# Altium schematic sheet Kilobot_Controller_IR.SchDoc
size A4
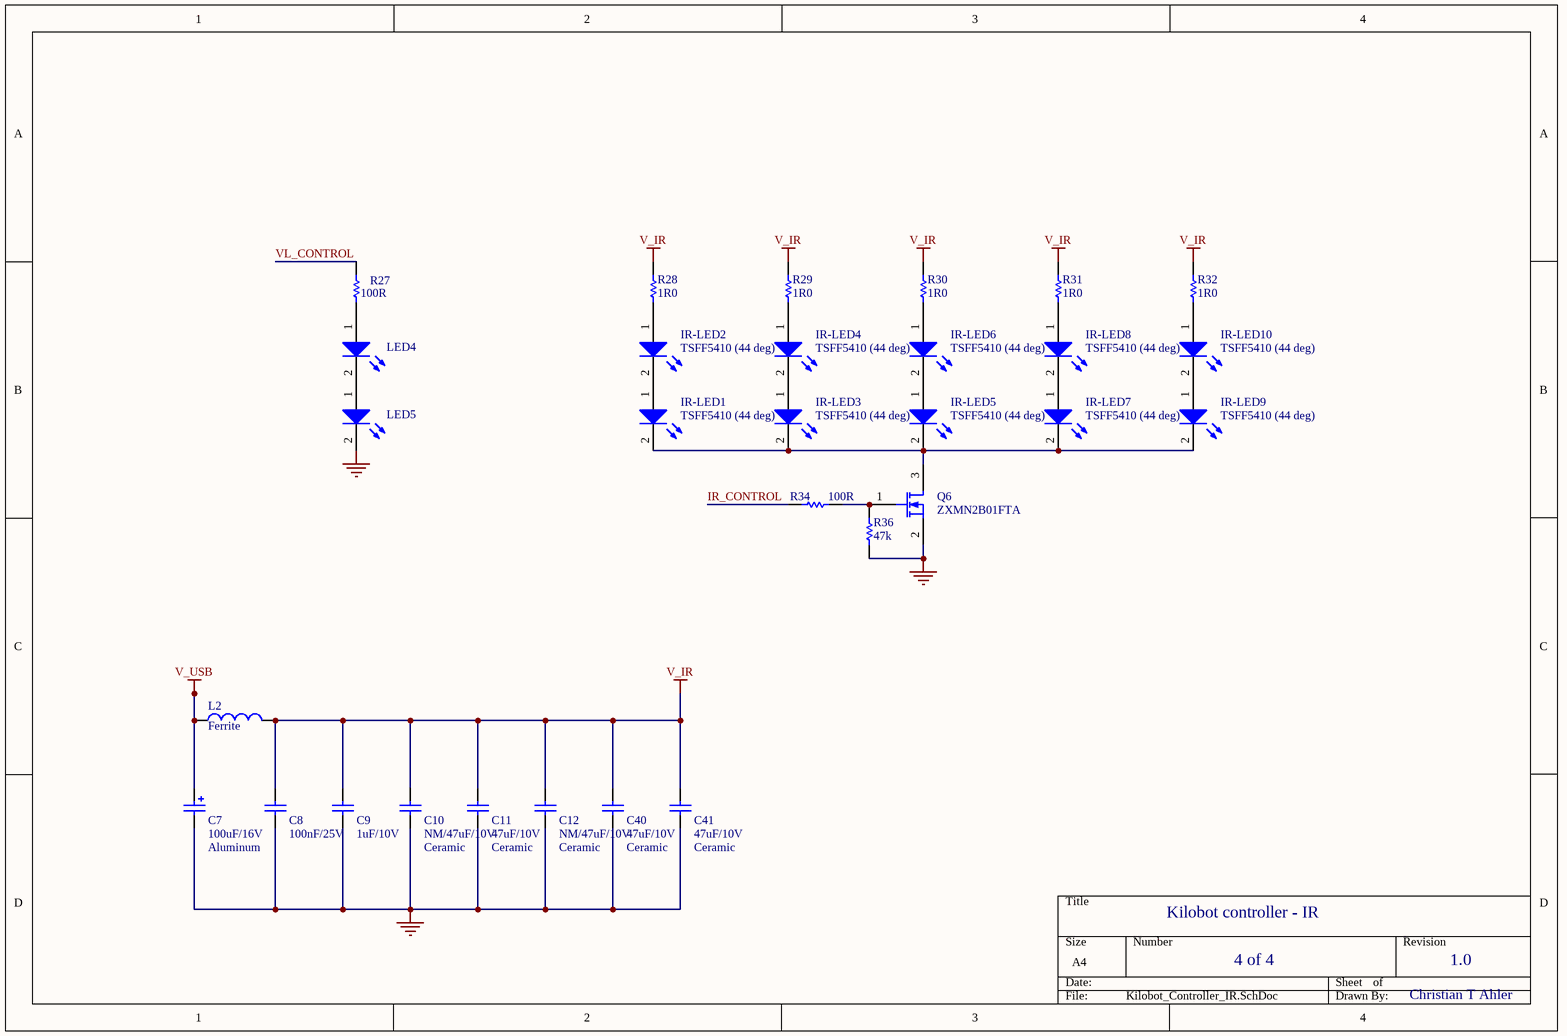
[diagram p0: Kilobot_Controller_IR.SchDoc]

## Parts
C7  Aluminum  value 100uF/16V  [cap5mm]
C8  value 100nF/25V  [RESC1608L]  (hidden comment: C0603)
C9  value 1uF/10V  [RESC1608L]  (hidden comment: C0603)
C10  Ceramic  value NM/47uF/10V  [8RB-1206]
C11  Ceramic  value 47uF/10V  [8RB-1206]
C12  Ceramic  value NM/47uF/10V  [8RB-1206]
C40  Ceramic  value 47uF/10V  [8RB-1206]
C41  Ceramic  value 47uF/10V  [8RB-1206]
IR-LED1  value TSFF5410 (44 deg)  [IR-LED]  (hidden comment: IR-LED)
IR-LED2  value TSFF5410 (44 deg)  [IR-LED]  (hidden comment: IR-LED)
IR-LED3  value TSFF5410 (44 deg)  [IR-LED]  (hidden comment: IR-LED)
IR-LED4  value TSFF5410 (44 deg)  [IR-LED]  (hidden comment: IR-LED)
IR-LED5  value TSFF5410 (44 deg)  [IR-LED]  (hidden comment: IR-LED)
IR-LED6  value TSFF5410 (44 deg)  [IR-LED]  (hidden comment: IR-LED)
IR-LED7  value TSFF5410 (44 deg)  [IR-LED]  (hidden comment: IR-LED)
IR-LED8  value TSFF5410 (44 deg)  [IR-LED]  (hidden comment: IR-LED)
IR-LED9  value TSFF5410 (44 deg)  [IR-LED]  (hidden comment: IR-LED)
IR-LED10  value TSFF5410 (44 deg)  [IR-LED]  (hidden comment: IR-LED)
L2  Ferrite  [RESC2012N]
LED4  LED  [LED0603]  (value not drawn)
LED5  LED  [LED0603]  (value not drawn)
Q6  value ZXMN2B01FTA  [sot23-3]  (hidden comment: NMOS23)
R27  value 100R  [RESC1608L]  (hidden comment: Res1)
R28  value 1R0  [RESC2012L]  (hidden comment: Res1)
R29  value 1R0  [RESC2012L]  (hidden comment: Res1)
R30  value 1R0  [RESC2012L]  (hidden comment: Res1)
R31  value 1R0  [RESC2012L]  (hidden comment: Res1)
R32  value 1R0  [RESC2012L]  (hidden comment: Res1)
R34  value 100R  [RESC1608L]  (hidden comment: Res1)
R36  value 47k  [RESC1608L]  (hidden comment: Res1)

## Nets
GND: C7.2 C8.2 C9.1 C10.1 C11.1 C12.1 C40.1 C41.1 LED5.2(K) Q6.2(S) R36.1
V_IR: C8.1 C9.2 C10.2 C11.2 C12.2 C40.2 C41.2 L2.2 R28.2 R29.2 R30.2 R31.2 R32.2
V_USB: C7.1 L2.1
IR_CONTROL: R34.2
VL_CONTROL: R27.2
NetIR-LED1_1: IR-LED1.1(A) IR-LED2.2(K)
NetIR-LED1_2: IR-LED1.2(K) IR-LED3.2(K) IR-LED5.2(K) IR-LED7.2(K) IR-LED9.2(K) Q6.3(D)
NetIR-LED2_1: IR-LED2.1(A) R28.1
NetIR-LED3_1: IR-LED3.1(A) IR-LED4.2(K)
NetIR-LED4_1: IR-LED4.1(A) R29.1
NetIR-LED5_1: IR-LED5.1(A) IR-LED6.2(K)
NetIR-LED6_1: IR-LED6.1(A) R30.1
NetIR-LED7_1: IR-LED7.1(A) IR-LED8.2(K)
NetIR-LED8_1: IR-LED8.1(A) R31.1
NetIR-LED9_1: IR-LED9.1(A) IR-LED10.2(K)
NetIR-LED10_1: IR-LED10.1(A) R32.1
NetLED4_1: LED4.1(A) R27.1
NetLED4_2: LED4.2(K) LED5.1(A)
NetQ6_1: Q6.1(G) R34.1 R36.2

## Notes on the sheet
- Kilobot controller - IR
- 4 of 4
- 1.0
- Christian T Ahler

## Library data of the parts
C7 = CAP: Order code: 493-1040-ND
C8 = C0603: Ceramic Chip Capacitor - Standard; Order code: 445-1316-1-ND
C9 = C0603: Ceramic Chip Capacitor - Standard; Order code: 445-1328-1-ND
C10 C12 = CAP2220: Order code: DNO
C11 C40 C41 = CAP2220: Order code: 490-3907-1-ND
IR-LED1-IR-LED10 = IR-LED: Order code: 751-1208-ND
L2 = Inductor: Value: 1k @ 100MHz; Order code: 445-5223-1-ND
LED4 LED5 = LED: Value: LED Blue; Order code: LNJ937W8CRACT-ND
Q6 = NMOS23: Order code: ZXMN2B01FCT-ND; Alternative: SI2302ADS-T1-E3CT-ND
R27 R34 = Res1: Resistor; Order code: P100HCT-ND
R28-R32 = Res1: Resistor; Order code: RMCF0805JT1R00CT-ND
R36 = Res1: Resistor; Order code: P47.0KHCT-ND